# Altium schematic sheet WR_MEZZANINE.SchDoc
size A4
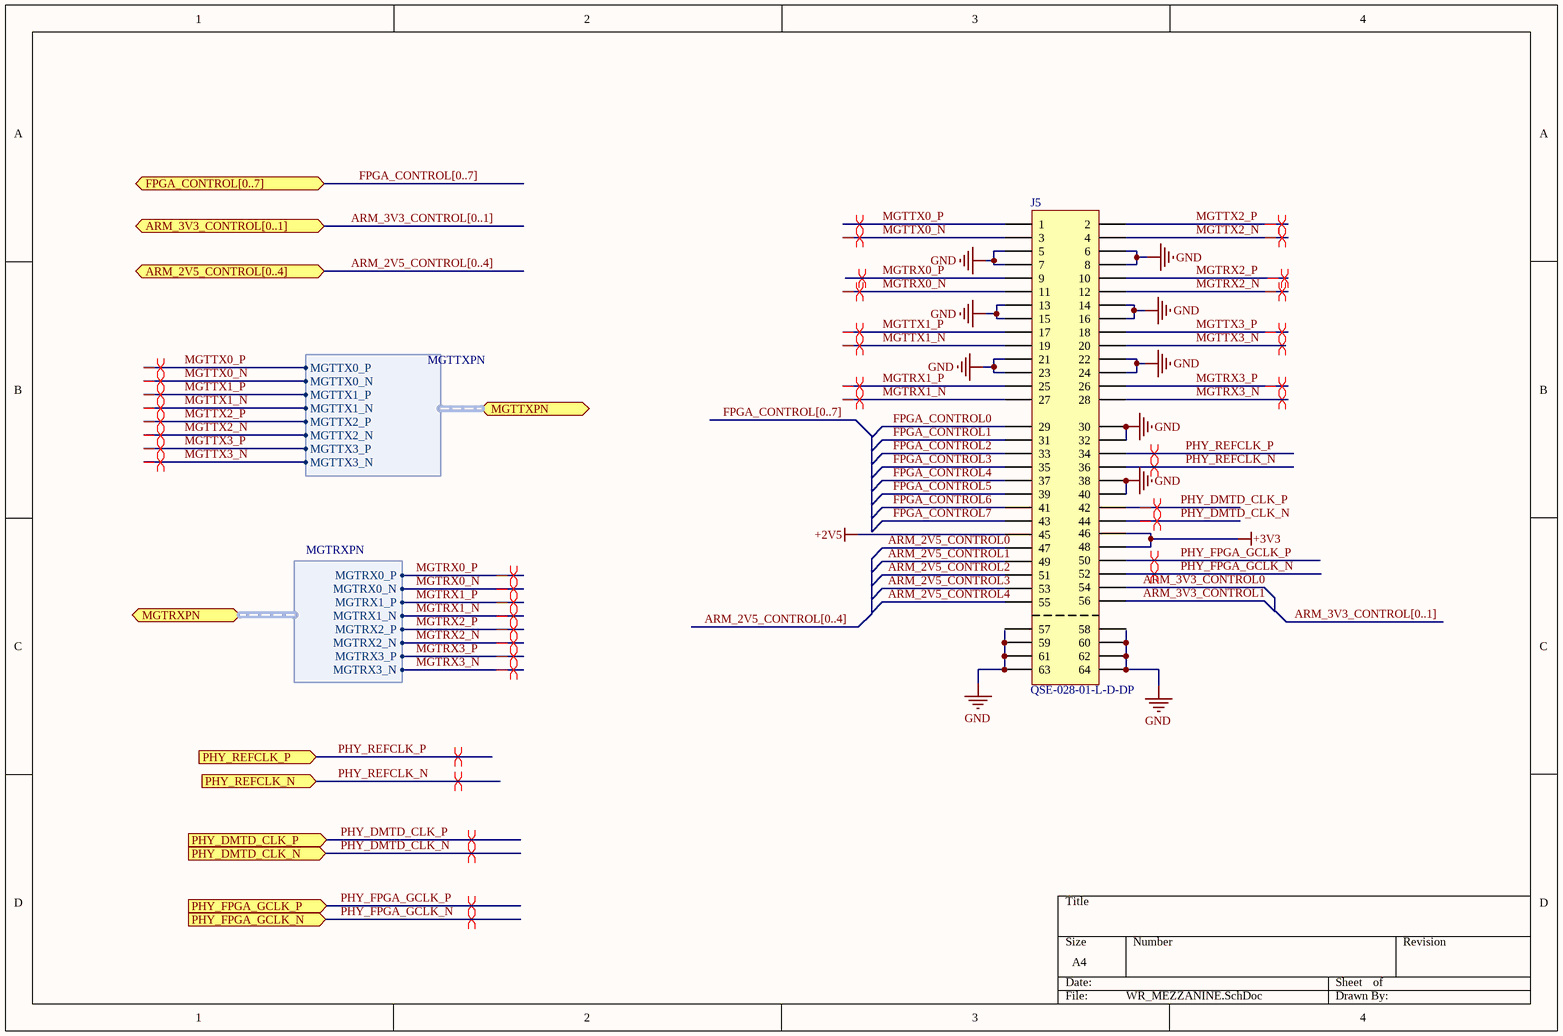
[diagram p0: WR_MEZZANINE.SchDoc]

## Parts
J5  QSE-028-01-L-D-DP  [QSE-028-01-X-D-DP-A]

## Ports
ARM_2V5_CONTROL[0..4] (bidir), ARM_3V3_CONTROL[0..1] (bidir), FPGA_CONTROL[0..7] (bidir), MGTRXPN (harness MGTRXPN), MGTTXPN (harness MGTTXPN), PHY_DMTD_CLK_N (in), PHY_DMTD_CLK_P (in), PHY_FPGA_GCLK_N (in), PHY_FPGA_GCLK_P (in), PHY_REFCLK_N (in), PHY_REFCLK_P (in)

## Harnesses
MGTTXPN: MGTTX0_P, MGTTX0_N, MGTTX1_P, MGTTX1_N, MGTTX2_P, MGTTX2_N, MGTTX3_P, MGTTX3_N
MGTRXPN: MGTRX0_P, MGTRX0_N, MGTRX1_P, MGTRX1_N, MGTRX2_P, MGTRX2_N, MGTRX3_P, MGTRX3_N

## Nets
+2V5: J5.45
+3V3: J5.46 J5.48
GND: J5.5 J5.6 J5.7 J5.8 J5.13 J5.14 J5.15 J5.16 J5.21 J5.22 J5.23 J5.24 J5.30 J5.32 J5.38 J5.40 J5.59 J5.60 J5.61 J5.62 J5.63 J5.64
ARM_2V5_CONTROL0: J5.47
ARM_2V5_CONTROL1: J5.49
ARM_2V5_CONTROL2: J5.51
ARM_2V5_CONTROL3: J5.53
ARM_2V5_CONTROL4: J5.55
ARM_3V3_CONTROL0: J5.54
ARM_3V3_CONTROL1: J5.56
FPGA_CONTROL0: J5.29
FPGA_CONTROL1: J5.31
FPGA_CONTROL2: J5.33
FPGA_CONTROL3: J5.35
FPGA_CONTROL4: J5.37
FPGA_CONTROL5: J5.39
FPGA_CONTROL6: J5.41
FPGA_CONTROL7: J5.43
MGTRX0_N: J5.11 ; port MGTRXPN.MGTRX0_N
MGTRX0_P: J5.9 ; port MGTRXPN.MGTRX0_P
MGTRX1_N: J5.27 ; port MGTRXPN.MGTRX1_N
MGTRX1_P: J5.25 ; port MGTRXPN.MGTRX1_P
MGTRX2_N: J5.12 ; port MGTRXPN.MGTRX2_N
MGTRX2_P: J5.10 ; port MGTRXPN.MGTRX2_P
MGTRX3_N: J5.28 ; port MGTRXPN.MGTRX3_N
MGTRX3_P: J5.26 ; port MGTRXPN.MGTRX3_P
MGTTX0_N: J5.3 ; port MGTTXPN.MGTTX0_N
MGTTX0_P: J5.1 ; port MGTTXPN.MGTTX0_P
MGTTX1_N: J5.19 ; port MGTTXPN.MGTTX1_N
MGTTX1_P: J5.17 ; port MGTTXPN.MGTTX1_P
MGTTX2_N: J5.4 ; port MGTTXPN.MGTTX2_N
MGTTX2_P: J5.2 ; port MGTTXPN.MGTTX2_P
MGTTX3_N: J5.20 ; port MGTTXPN.MGTTX3_N
MGTTX3_P: J5.18 ; port MGTTXPN.MGTTX3_P
PHY_DMTD_CLK_N: J5.44 ; port PHY_DMTD_CLK_N
PHY_DMTD_CLK_P: J5.42 ; port PHY_DMTD_CLK_P
PHY_FPGA_GCLK_N: J5.52 ; port PHY_FPGA_GCLK_N
PHY_FPGA_GCLK_P: J5.50 ; port PHY_FPGA_GCLK_P
PHY_REFCLK_N: J5.36 ; port PHY_REFCLK_N
PHY_REFCLK_P: J5.34 ; port PHY_REFCLK_P

Not connected (* = marked no-connect by the designer): J5 57 58

## Buses and harness runs
bus ARM_2V5_CONTROL[0..4]
bus ARM_2V5_CONTROL[0..4] = port ARM_2V5_CONTROL[0..4]
bus ARM_3V3_CONTROL[0..1]
bus ARM_3V3_CONTROL[0..1] = port ARM_3V3_CONTROL[0..1]
bus FPGA_CONTROL[0..7]
bus FPGA_CONTROL[0..7] = port FPGA_CONTROL[0..7]

## Layout directives
differential pair: MGTRX0_N, MGTRX0_P, MGTRX1_N, MGTRX1_P, MGTRX2_N, MGTRX2_P, MGTRX3_N, MGTRX3_P, MGTTX0_N, MGTTX0_P, MGTTX1_N, MGTTX1_P, MGTTX2_N, MGTTX2_P, MGTTX3_N, MGTTX3_P, PHY_DMTD_CLK_N, PHY_DMTD_CLK_P, PHY_FPGA_GCLK_N, PHY_FPGA_GCLK_P, PHY_REFCLK_N, PHY_REFCLK_P

## Library data of the parts
J5 = QSE-028-01-L-D-DP: High Speed Ground Plane Header